# EAGLE design 13448_ATMEGA328_prog (EAGLE 7.7.0)
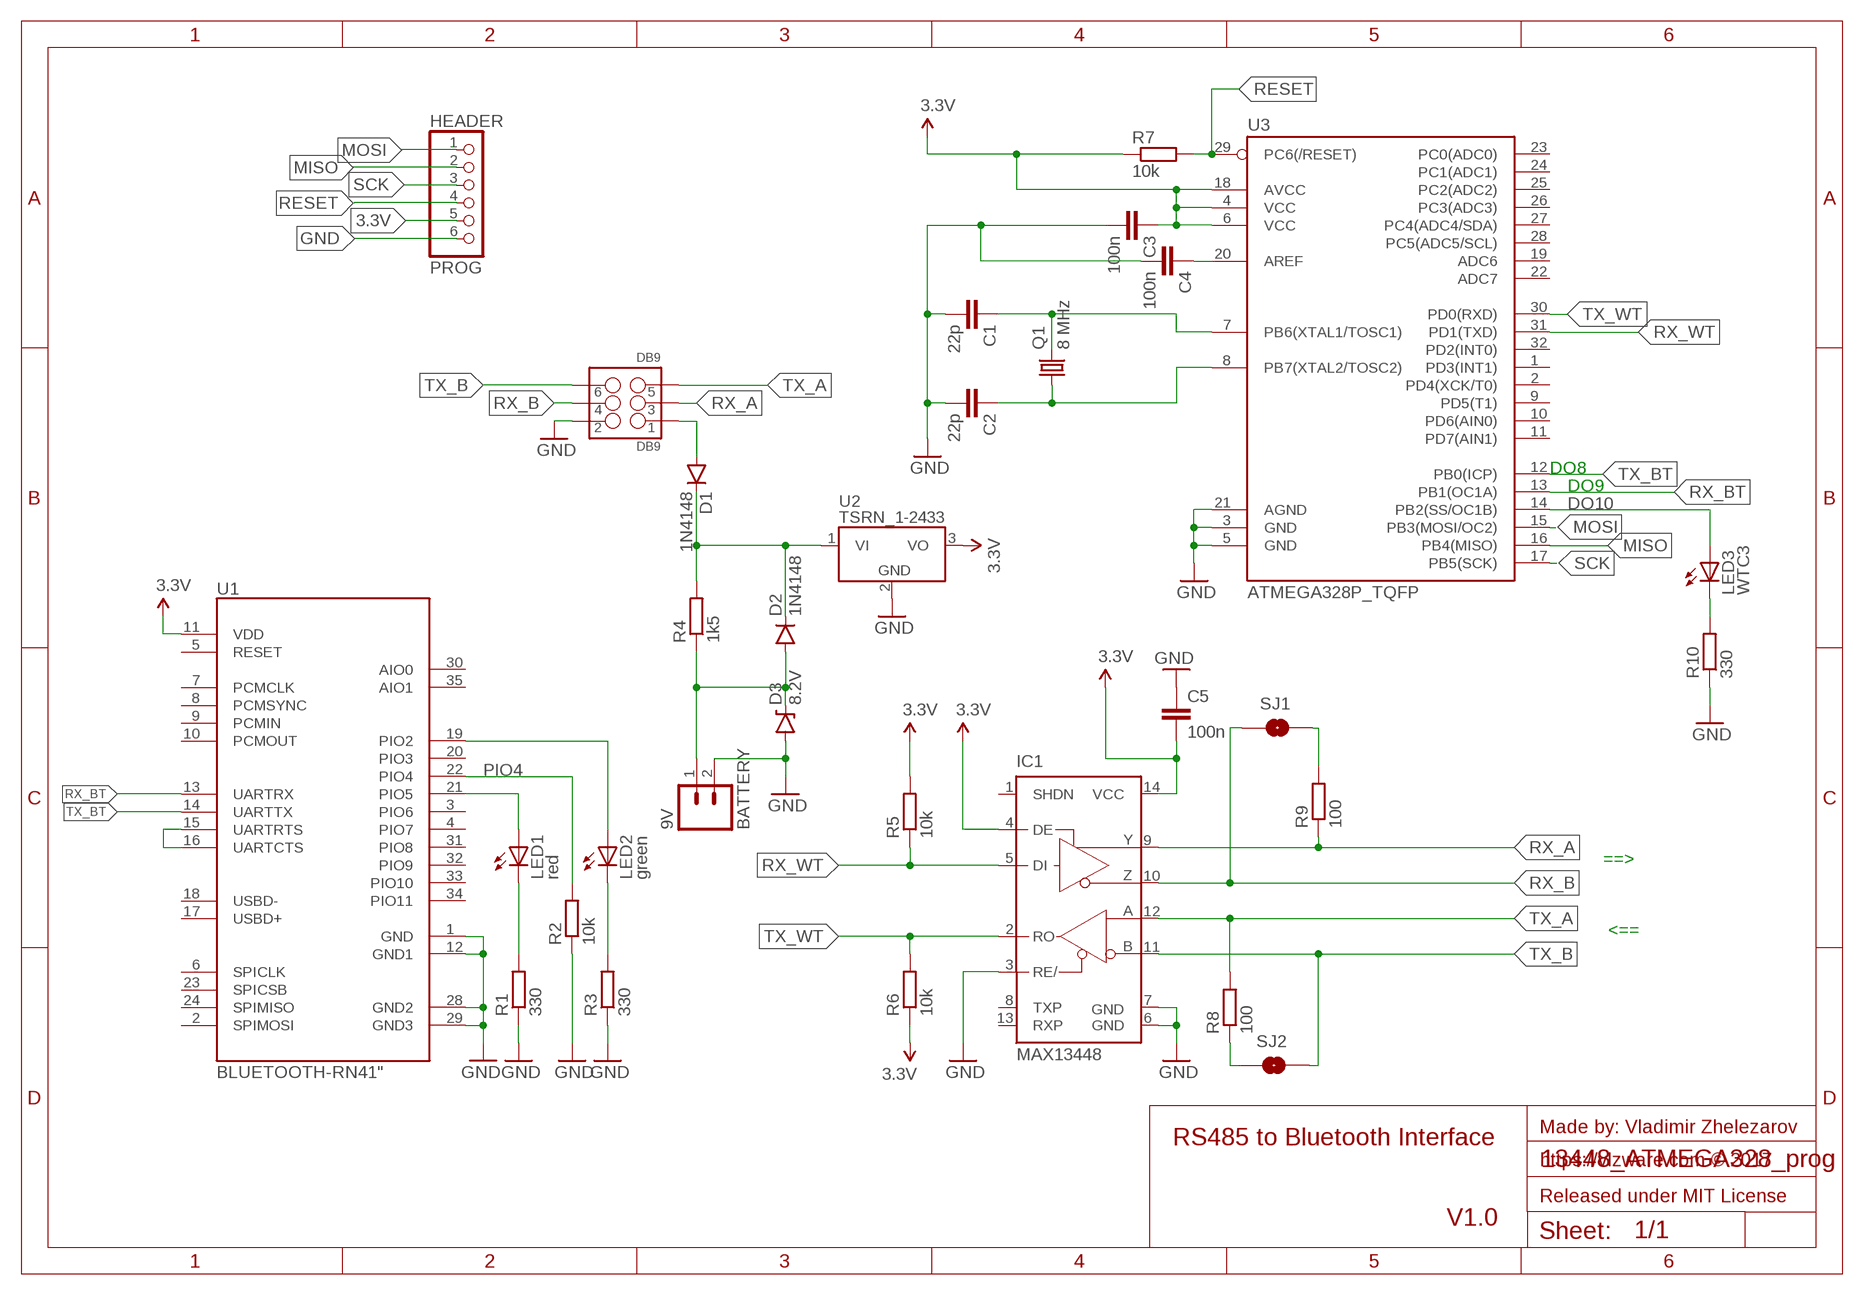
[diagram p0: schematic, sheet 1]

## Parts
BATTERY  9V  M02LOCK  [1X02_LOCK]
C1  22p  CAP1206  [1206]
C2  22p  CAP1206  [1206]
C3  100n  CAP1206  [1206]
C4  100n  CAP1206  [1206]
C5  100n  CAP1206  [1206]
D1  1N4148  DIODE1N4148  [DIODE-1N4148]
D2  1N4148  DIODE1N4148  [DIODE-1N4148]
D3  8.2V  DIODE-ZENER  [DIODE-BZT52]
DB9  DB9  M03X22X3_SILK_MALE_PTH  [2X3]
HEADER  PROG  PINHD-1X6  [1X06]
IC1  MAX13448  MAX3465CSD  [SO14]
LED1  red  LED3MM  [LED3MM]
LED2  green  LED3MM  [LED3MM]
LED3  WTC3  LED3MM  [LED3MM]
Q1  8 MHz  CRYSTALHC49UP  [HC49UP]
R1  330  R-EU_M1206  [M1206]
R2  10k  R-EU_M1206  [M1206]
R3  330  R-EU_M1206  [M1206]
R4  1k5  R-EU_0204/2V  [0204V]
R5  10k  R-EU_M1206  [M1206]
R6  10k  R-EU_M1206  [M1206]
R7  10k  R-EU_M1206  [M1206]
R8  100  R-EU_M1206  [M1206]
R9  100  R-EU_M1206  [M1206]
R10  330  R-EU_M1206  [M1206]
SJ1  SOLDERJUMPERNC  [SJ_2S]
SJ2  SOLDERJUMPERNC  [SJ_2S]
U1  BLUETOOTH-RN41"  [RN41]
U2  TSRN_1-2433  TSR_1-2450  [TSR-1]
U3  ATMEGA328P_TQFP  [TQFP32-08]

## Nets
3.3V: C3.1 C5.2 HEADER.5 IC1.4(DE) IC1.14(VCC) R5.2 R6.1 R7.1 U1.11(VDD) U2.3(VO) U3.4(VCC) U3.6(VCC) U3.18(AVCC)
24V: D1.A DB9.1
D1: LED1.K(C) R1.2
D2: LED2.K(C) R3.2
DO10: LED3.A U3.14(PB2(SS/OC1B))
GND: BATTERY.2 C1.2 C2.2 C3.2 C4.2 C5.1 D3.A DB9.2 HEADER.6 IC1.3(RE/) IC1.6(GND) IC1.7(GND) R1.1 R2.1 R3.1 R10.1 U1.1(GND) U1.12(GND1) U1.28(GND2) U1.29(GND3) U2.2(GND) U3.3(GND) U3.5(GND) U3.21(AGND)
MISO: HEADER.2 U3.16(PB4(MISO))
MOSI: HEADER.1 U3.15(PB3(MOSI/OC2))
N$1: LED1.A U1.21(PIO5)
N$2: LED2.A U1.19(PIO2)
N$3: U1.15(UARTRTS) U1.16(UARTCTS)
N$6: LED3.K(C) R10.2
N$7: R8.1 SJ2.1
N$8: R9.2 SJ1.2
N$11: BATTERY.1 D2.A D3.C R4.1
N$23: C4.1 U3.20(AREF)
N$25: C1.1 Q1.2 U3.7(PB6(XTAL1/TOSC1))
N$26: C2.1 Q1.1 U3.8(PB7(XTAL2/TOSC2))
PIO4: R2.2 U1.22(PIO4)
RESET: HEADER.4 R7.2 U3.29(PC6(/RESET))
RX_A: DB9.3 IC1.9(Y) R9.1
RX_B: DB9.4 IC1.10(Z) SJ1.1
RX_BT: U1.13(UARTRX) U3.13(PB1(OC1A))
RX_WT: IC1.5(DI) R5.1 U3.31(PD1(TXD))
SCK: HEADER.3 U3.17(PB5(SCK))
TX_A: DB9.5 IC1.12(A) R8.2
TX_B: DB9.6 IC1.11(B) SJ2.2
TX_BT: U1.14(UARTTX) U3.12(PB0(ICP))
TX_WT: IC1.2(RO) R6.2 U3.30(PD0(RXD))
VI: D1.C D2.C R4.2 U2.1(VI)
Unconnected: IC1.1(SHDN) IC1.8(TXP) IC1.13(RXP) U1.2(SPIMOSI) U1.3(PIO6) U1.4(PIO7) U1.5(RESET) U1.6(SPICLK) U1.7(PCMCLK) U1.8(PCMSYNC) U1.9(PCMIN) U1.10(PCMOUT) U1.17(USBD+) U1.18(USBD-) U1.20(PIO3) U1.23(SPICSB) U1.24(SPIMISO) U1.30(AIO0) U1.31(PIO8) U1.32(PIO9) U1.33(PIO10) U1.34(PIO11) U1.35(AIO1) U3.1(PD3(INT1)) U3.2(PD4(XCK/T0)) U3.9(PD5(T1)) U3.10(PD6(AIN0)) U3.11(PD7(AIN1)) U3.19(ADC6) U3.22(ADC7) U3.23(PC0(ADC0)) U3.24(PC1(ADC1)) U3.25(PC2(ADC2)) U3.26(PC3(ADC3)) U3.27(PC4(ADC4/SDA)) U3.28(PC5(ADC5/SCL)) U3.32(PD2(INT0))

## Notes on the sheet
- DO8
- DO9
- ==>
- <==
- Made by: Vladimir Zhelezarov
- RS485 to Bluetooth Interface
- https://vlzware.com © 2017
- Released under MIT License
- V1.0

## Library data of the parts
BATTERY = SparkFun-Connectors:M02: Standard 2-pin 0.1" header. Use with - straight break away headers ( PRT-00116) - right angle break away headers (PRT-00553) - swiss pins (PRT-00743) - machine pins (PRT-00117) - female headers (PRT-00115) Molex polarized connector foot print use with: PRT-08233 with associated crimp pins and housings. 2.54_SCREWTERM for use with PRT-10571. 3.5mm Screw Terminal footprints for PRT-08084 5mm Screw Terminal footprints for use with PRT-08432
C1-C5 = SparkFun-Capacitors:CAP: Capacitor Standard 0603 ceramic capacitor, and 0.1" leaded capacitor.
D1 D2 = SparkFun-DiscreteSemi:DIODE: Diode These are standard reverse protection diodes and small signal diodes. SMA package can handle up to about 1A. SOD-323 can handle about 200mA. What the SOD-323 package when ordering, there are some mfgs out there that are 5-pin packages.; PROD_ID: DIO-08378
D3 = SparkFun-DiscreteSemi:DIODE-ZENER: Zener Diode Production Part - 8199 3.4V Zener Voltage; PROD-ID: DIO-08199; VALUE: BZT52
DB9 = SparkFun-Connectors:M03X2: 2x3 .1" header. Shrouded, with keying- CONN-10681 SMT- CONN-11415 Pogo pins- HW-11044; PROD_ID: CONN-09701
HEADER = pinhead:PINHD-1X6: PIN HEADER
IC1 = maxim:MAX346*: +5V, Fail-Safe, 40Mbps, Profibus RS-485/RS-422 Transceivers Source: MAX3465-MAX3469.pdf; MPN: MAX3465CSD+; OC_FARNELL: unknown; OC_NEWARK: 65K6814
LED1-LED3 = adafruit:LED: LED OSRAM: - CHIPLED LG R971, LG N971, LY N971, LG Q971, LY Q971, LO R971, LY R971 LH N974, LH R974 LS Q976, LO Q976, LY Q976 LO Q996 - Hyper CHIPLED LW Q18S LB Q993, LB Q99A, LB R99A - SideLED LS A670, LO A670, LY A670, LG A670, LP A670 LB A673, LV A673, LT A673, LW A673 LH A674 LY A675 LS A676, LA A676, LO A676, LY A676, LW A676 LS A679, LY A679, LG A679 - Hyper Micro SIDELED® LS Y876, LA Y876, LO Y876, LY Y876 LT Y87S - SmartLED LW L88C, LW L88S LB L89C, LB L89S, LG L890 LS L89K, LO L89K, LY L89K LS L896, LA L896, LO L896, LY L896 - TOPLED LS T670, LO T670, LY T670, LG T670, LP T670 LSG T670, LSP T670, LSY T670, LOP T670, LYG T670 LG T671, LOG T671, LSG T671 LB T673, LV T673, LT T673, LW T673 LH T674 LS T676, LA T676, LO T676, LY T676, LB T676, LH T676, LSB T676, LW T676 LB T67C, LV T67C, LT T67C, LS T67K, LO T67K, LY T67K, LW E67C LS E67B, LA E67B, LO E67B, LY E67B, LB E67C, LV E67C, LT E67C LW T67C LS T679, LY T679, LG T679 LS T770, LO T770, LY T770, LG T770, LP T770 LB T773, LV T773, LT T773, LW T773 LH T774 LS E675, LA E675, LY E675, LS T675 LS T776, LA T776, LO T776, LY T776, LB T776 LHGB T686 LT T68C, LB T68C - Hyper Mini TOPLED® LB M676 - Mini TOPLED Santana® LG M470 LS M47K, LO M47K, LY M47K Source: http://www.osram.convergy.de/
Q1 = adafruit:CRYSTAL: CRYSTAL; OC_FARNELL: unknown; OC_NEWARK: unknown
R1-R10 = resistor:R-EU_: RESISTOR, European symbol
SJ1 SJ2 = SparkFun-Retired:SOLDERJUMPER: Solder Jumper Standard SMD solder jumper. Used to automate production. Two varients : Normally Open and Normally Closed are the same, but have different paste layers. NC will have a large amount of paste and should jumper during reflow.
U1 = SparkFun-RF:BLUETOOTH-RN41: Bluetooth SMD module
U2 = _traco_tsr-1:TSR_1-*: TRACO TSR-1 Series Point-of-Load DC/DC-Converters Vi max. 36 V; Vo = (1.2 .. 15)V ±2%; Io = 0 .. 1 A SIP-Package (drop-in replacement for 78xx linear voltage regulators in TO220-package, vertically assembled) Source: www.tracopower.com Technologies: TSR 1- Vi (V) Vo (V) ±2% Io = 0 .. 1 A 24_ ( generic ) 2412 4.6 .. 36 1.2 2415 4.6 .. 36 1.5 2418 4.6 .. 36 1.8 2425 4.6 .. 36 2.5 2433 4.75.. 36 3.3 2450 6.5 .. 36 5.0 2465 9.0 .. 36 6.5 2490 12 .. 36 9.0 24120 15 .. 36 12 24150 18 .. 36 15 Author: Dipl.-Ing. FH Rainer Bayer HHN Hochschule Heilbronn, rainer.bayer@hs-heilbronn.de Ingenieurbüro ing-rb, mail@ing-rb.de
U3 = SparkFun-DigitalIC:ATMEGA328P_TQFP; PROD_ID: IC-09069

## Board
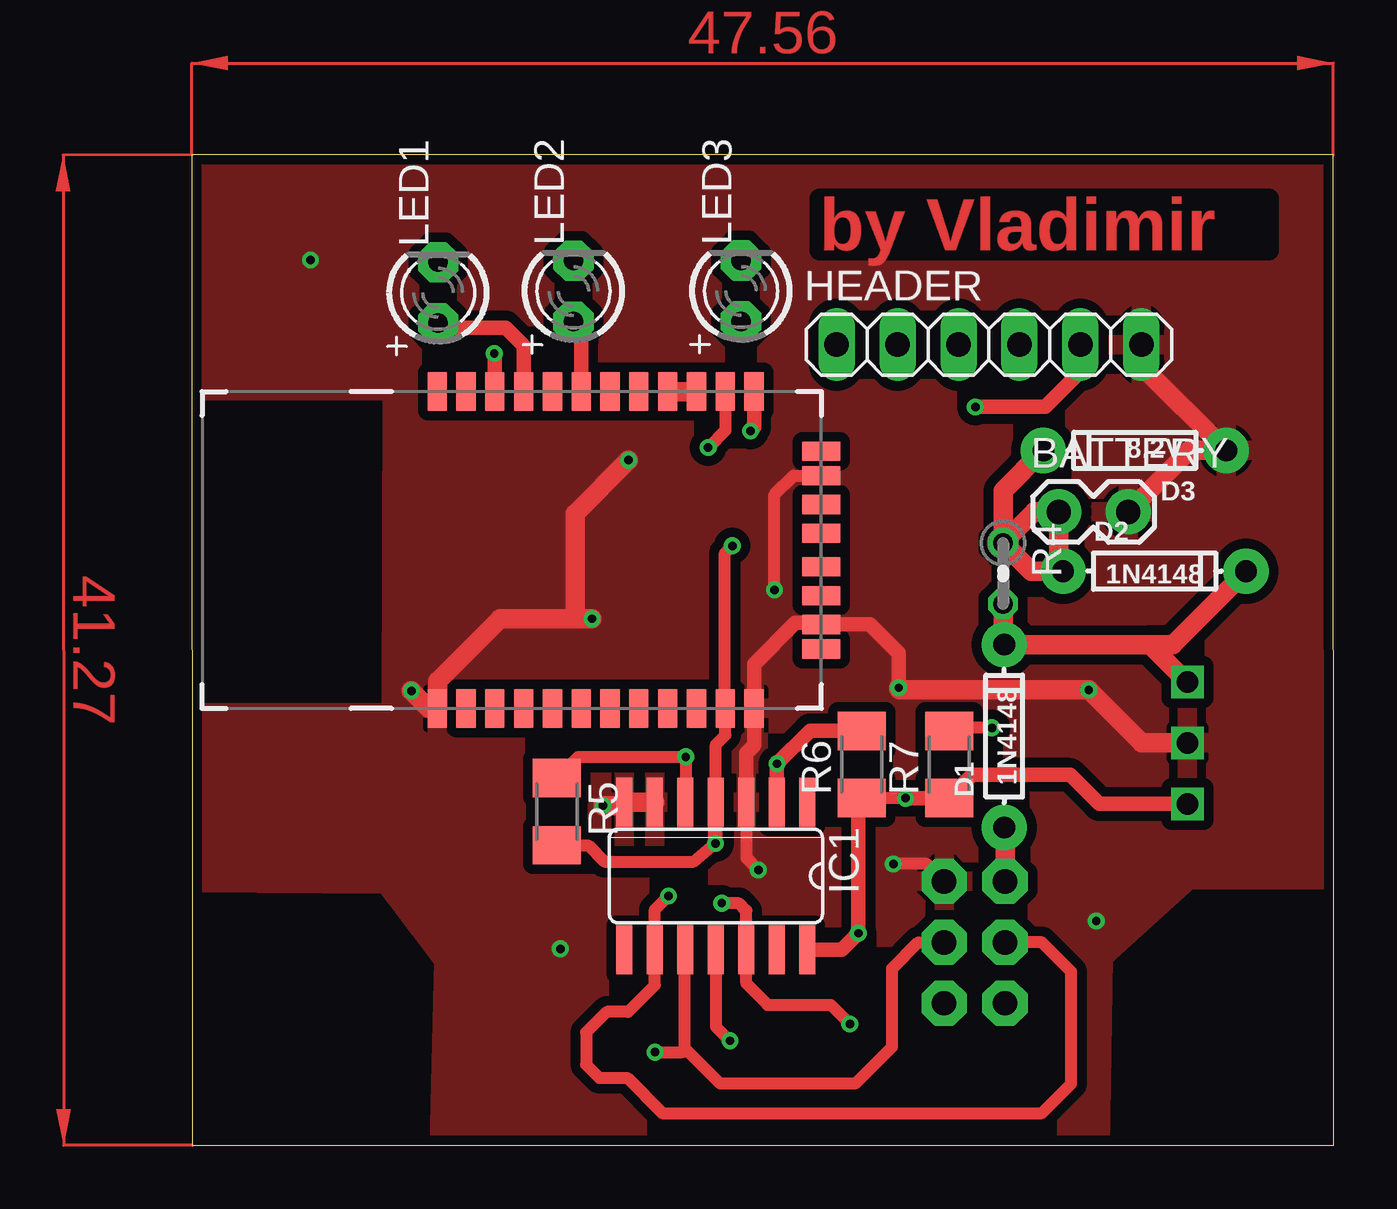
[diagram p1: board, top side]
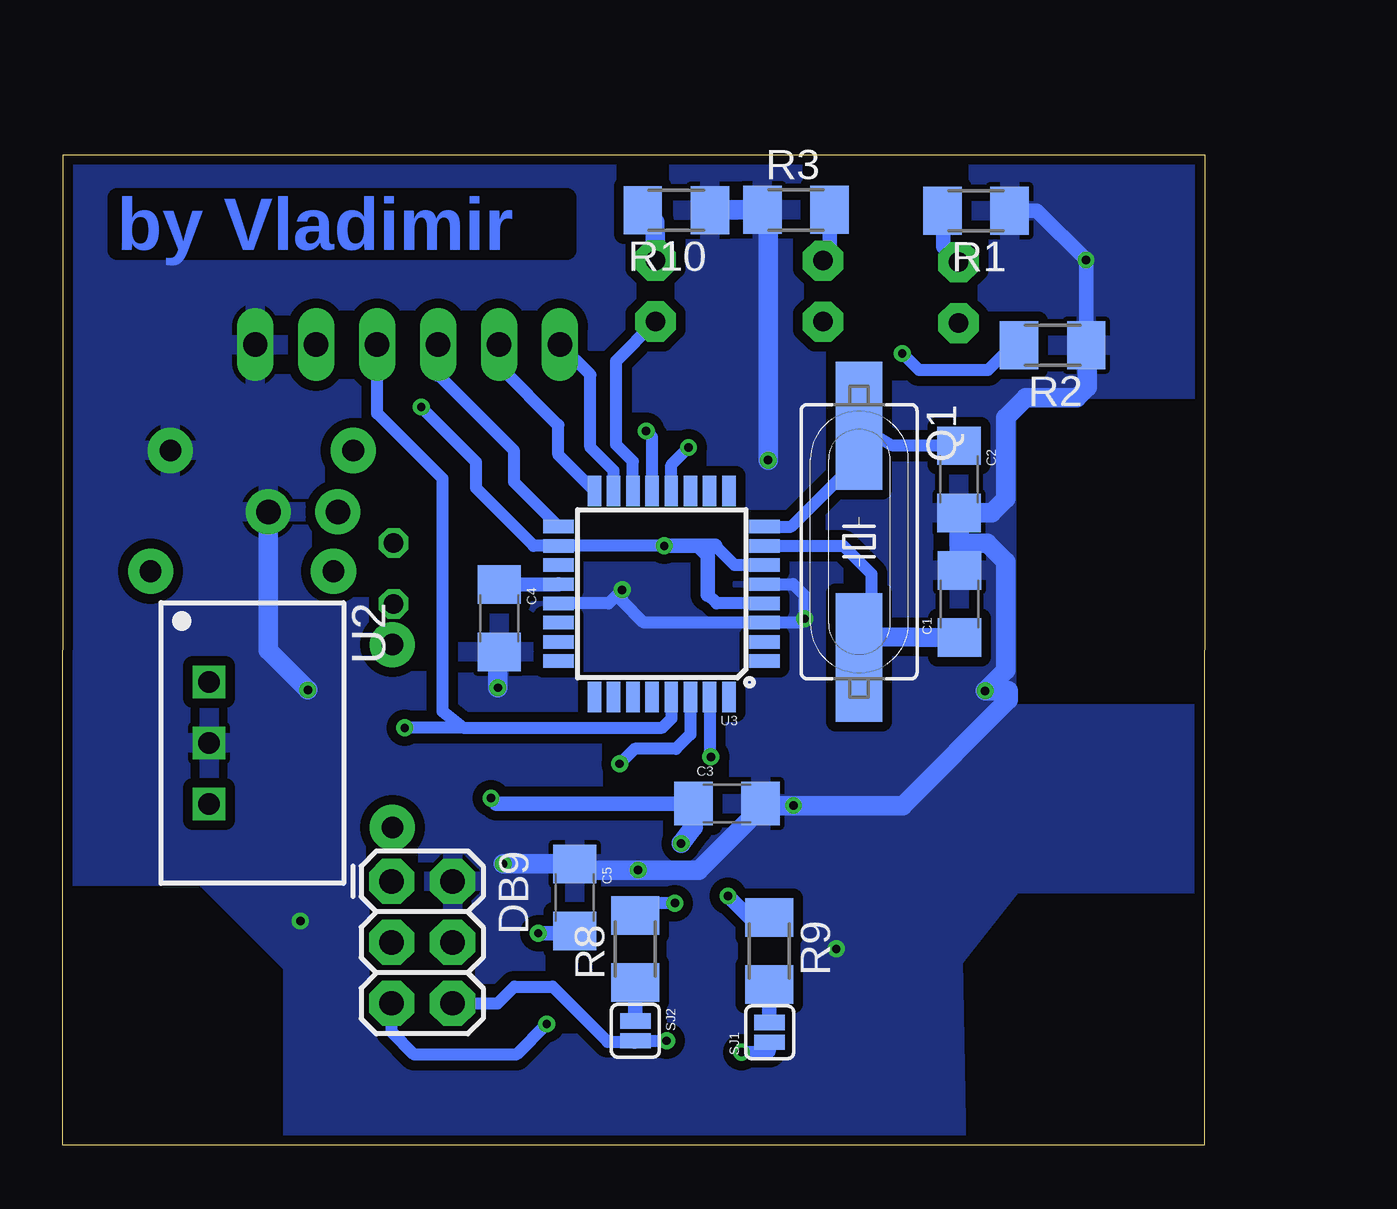
[diagram p2: board, bottom side, seen from below]

Size 47.58 x 41.27 mm. Coordinates in mm from the lower left corner, seen from the top.
Outline: 0.02,0 47.58,0 47.56,41.27 0,41.27 0.02,0
Copper layers (1*16): Top 0.018mm / dielectric 1.55mm / Bottom 0.018mm
Design rules "eC_2Layer_PClass6_BaseCopperO18_eCDefault": minimum track width 0.15mm, minimum drill 0.35mm, track to track 0.15mm, track to pad 0.15mm, pad to pad 0.15mm, via to via 0.15mm, smd to smd 0mil, copper to edge 0.25mm, drill to drill 0.35mm, minimum pad ring 0.175mm, minimum via ring 0.125mm, stop-mask expansion 0mil, vias tented up to drill 0.45mm, thermal gap 0.2mm

### Footprints (pad centres in the part's own frame; a part is rotated, then mirrored left to right if it is on the bottom)
1X02_LOCK = drill 1.016 pad 1.88: 1 -0.178,0; 2 2.718,0
1206 = smd 1.6 x 1.8: 1 -1.4,0; 2 1.4,0
DIODE-1N4148 = drill 0.9 pad 1.88: A -3.81,0; C 3.81,0
DIODE-BZT52 = drill 0.9 pad 1.88: A -3.81,0; C 3.81,0
2X3 = drill 1.016 pad 1.88 octagon: 1 0,0; 2 0,2.54; 3 2.54,0; 4 2.54,2.54; 5 5.08,0; 6 5.08,2.54
1X06 = drill 1.016 long: 1 -6.35,0; 2 -3.81,0; 3 -1.27,0; 4 1.27,0; 5 3.81,0; 6 6.35,0
SO14 = smd 0.66 x 2.032: 1 -3.81,-3.073; 2 -2.54,-3.073; 3 -1.27,-3.073; 4 0,-3.073; 5 1.27,-3.073; 6 2.54,-3.073; 7 3.81,-3.073; 8 3.81,3.073; 9 2.54,3.073; 10 1.27,3.073; 11 0,3.073; 12 -1.27,3.073; 13 -2.54,3.073; 14 -3.81,3.073
LED3MM = drill 0.813 pad 1.676 octagon: A -1.27,0; K 1.27,0
HC49UP = smd 5.334 x 1.93: 1 -4.826,0; 2 4.826,0
M1206 = smd 1.6 x 2: 1 -1.4,0; 2 1.4,0
0204V = drill 0.813 octagon: 1 -1.27,0; 2 1.27,0
SJ_2S = smd 0.635 x 1.27: 1 -0.412,0; 2 0.412,0
RN41 = smd 0.8 x 1.6: 1 -6.6,-6.6; 2 -5.4,-6.6; 3 -4.2,-6.6; 4 -3,-6.6; 5 -1.8,-6.6; 6 -0.6,-6.6; 7 0.6,-6.6; 8 1.8,-6.6; 9 3,-6.6; 10 4.2,-6.6; 11 5.4,-6.6; 12 6.6,-6.6; 13 6.6,6.6; 14 5.4,6.6; 15 4.2,6.6; 16 3,6.6; 17 1.8,6.6; 18 0.6,6.6; 19 -0.6,6.6; 20 -1.8,6.6; 21 -3,6.6; 22 -4.2,6.6; 23 -5.4,6.6; 24 -6.6,6.6 | smd 1.6 x 0.8: 28 9.4,3.1; 29 9.4,-3.1; 30 9.4,4.122; 31 9.4,1.9; 32 9.4,0.7; 33 9.4,-0.7; 34 9.4,-1.9; 35 9.4,-4.122
TSR-1 = drill 0.9 square: 1 -2.54,0; 2 0,0; 3 2.54,0
TQFP32-08 = smd 1.27 x 0.559: 1 -4.293,2.8; 2 -4.293,2; 3 -4.293,1.2; 4 -4.293,0.4; 5 -4.293,-0.4; 6 -4.293,-1.2; 7 -4.293,-2; 8 -4.293,-2.8; 17 4.293,-2.8; 18 4.293,-2; 19 4.293,-1.2; 20 4.293,-0.4; 21 4.293,0.4; 22 4.293,1.2; 23 4.293,2; 24 4.293,2.8 | smd 0.559 x 1.27: 9 -2.8,-4.293; 10 -2,-4.293; 11 -1.2,-4.293; 12 -0.4,-4.293; 13 0.4,-4.293; 14 1.2,-4.293; 15 2,-4.293; 16 2.8,-4.293; 25 2.8,4.293; 26 2,4.293; 27 1.2,4.293; 28 0.4,4.293; 29 -0.4,4.293; 30 -1.2,4.293; 31 -2,4.293; 32 -2.8,4.293

### Placement (x,y rotation side)
BATTERY  36.29,26.4 0 top
C1  10.22,22.55 90 bottom
C2  10.24,27.75 270 bottom
C3  19.9,14.24 0 bottom
C4  29.39,21.96 270 bottom
C5  26.24,10.32 270 bottom
D1  33.84,17.05 90 top
D2  40.11,23.92 0 top
D3  39.28,28.95 180 top
DB9  33.88,11 270 bottom
HEADER  33.21,33.36 0 top
IC1  21.83,11.22 180 top
LED1  10.26,35.53 90 top
LED2  15.9,35.59 90 top
LED3  22.88,35.6 90 top
Q1  14.4,25.15 270 bottom
R1  9.53,38.94 180 bottom
R2  6.33,33.34 180 bottom
R3  17.02,38.97 0 bottom
R4  33.79,23.83 270 top
R5  15.21,13.9 270 top
R6  27.9,15.87 90 top
R7  31.55,15.86 90 top
R8  23.73,8.18 90 bottom
R9  18.14,8.1 270 bottom
R10  22.01,38.97 180 bottom
SJ1  18.12,4.71 90 bottom
SJ2  23.72,4.77 270 bottom
U1  16.82,24.8 0 top
U2  41.48,16.77 270 bottom
U3  22.62,22.98 180 bottom

### Tracks (layer width: path | path; a pad name or v marks a point on that pad's centre or on a via)
3.3V  (via drill 0.35 pad 0.7)
  Top 0.508: IC1.4 21.83,16.7 22.22,17.09 U1.11 22.21,18.22 22.21,24.67 v22.51,24.98 | R5.2 16.5,12.5 17.18,11.82 20.9,11.82 v21.81,12.58 | v29.73,14.46 v29.72,14.47 R6.1 27.89,14.48 27.77,14.48
  Top 0.61: v32.64,30.77 35.56,30.77 37.02,32.23 HEADER.5 | U2.3 37.8,14.23 36.6,15.43 32.51,15.43 R7.1 v29.73,14.46 | IC1.4 v21.81,12.58 | IC1.14 27.08,8.15 v27.77,8.84 27.77,14.48 | 27.91,14.46 R6.1
  Bottom 0.508: v22.51,24.98 U3.18 27.95,24.98 30.36,27.38 30.36,28.46 32.66,30.77 | U3.6 19.58,24.18 20.39,24.98 | U3.4 20.33,22.58 20.7,22.95
  Bottom 0.61: 21.1,24.98 v22.51,24.98 | 21.1,24.98 20.39,24.98 | 20.7,22.95 20.7,24.58 21.1,24.98 | 32.66,30.77 v32.64,30.77 | 21.3,13.26 C3.1 29.51,14.24 v29.73,14.46 | v27.77,8.84 26.33,8.84 C5.2
  Bottom 0.813: v21.81,12.58 21.3,13.26
24V
  Top 0.813: DB9.1 33.88,13.21 D1.A
D1
  Bottom 0.61: 10.9,38.91 10.9,37.44 LED1.K
  Bottom 0.813: R1.2 10.9,38.91
D2
  Bottom 0.61: R3.2 15.62,37.13 LED2.K
  Bottom 0.813: R3.2
DO10
  Bottom 0.508: U3.14 23.82,28.5 24.52,29.2 24.52,32.68 LED3.A
GND  (via drill 0.35 pad 0.7)
  Top 0.508: DB9.2 30.61,11.72 v29.22,11.72 | IC1.3 23.1,11.97 v23.6,11.47 | v24.27,23.15 24.27,27.12 25.06,27.9 U1.28
  Top 0.61: IC1.3 23.1,16.34 23.43,16.67 23.43,18.2 U1.12 23.42,20.05 25.14,21.77 26.16,21.77 arc-90 U1.29 28.25,21.7 29.44,20.51 v29.45,19.07
  Top 0.813: IC1.6 IC1.7 17.88,14.16 v17.13,14.16 | v9.14,18.94 9.88,18.2 U1.1 10.23,18.22 10.23,19.33 12.85,21.94 15.96,21.94 | v16.67,21.94 15.96,21.94 | U2.2 39.58,16.77 v37.37,18.98 29.54,18.98 arc-90 v29.45,19.07 | HEADER.6 39.56,32.49 D3.A 41.57,28.95 BATTERY.2 | 15.96,21.94 15.96,26.32 v18.19,28.55
  Bottom 0.508: U3.21 24.84,22.58 v24.27,23.15 24.27,22.69 23.36,21.78 U3.3 16.83,21.78 v16.67,21.94 16.68,21.96 16.68,22.92 17.14,23.38 U3.5
  Bottom 0.61: R2.1 4.93,36.88 v4.94,36.89 7,38.94 R1.1
  Bottom 0.813: C1.2 10.22,25.14 | 10.22,25.14 10.22,26.33 C2.2 8.87,26.35 8.29,26.94 8.29,30.32 7.45,31.15 5.32,31.15 4.88,31.59 4.88,33.29 R2.1 | 10.22,25.14 10.16,25.08 9.06,25.08 8.29,24.31 8.29,19.79 v9.14,18.94 8.18,18.94 8.18,18.56 12.58,14.16 v17.13,14.16 18.41,14.16 C3.2 18.5,14.05 21.08,11.47 v23.6,11.47 25.99,11.47 C5.1 v29.22,11.72 | R10.1 R3.1 18.19,38.74 v18.19,28.55 | BATTERY.2 39.01,20.62 v37.37,18.98 | C4.2 29.45,20.5 v29.45,19.07
  other vias: 15.35,8.19 37.68,9.35
  pour Top (isolate 0.406): 8.34,31.42 8.31,18.03 0.09,18.03 0.03,10.94 8.07,10.88 10.5,7.68 10.3,-0.04 37.84,-0.07 37.98,7.83 41.54,11.06 47.54,11.06 47.54,41.13 0.04,41.13 0.04,31.43
  pour Bottom (isolate 0.406): -0.05,31.5 8.25,31.5 8.25,17.98 0.09,17.98 0.09,10.9 7.99,10.88 10.48,7.73 10.33,-0.12 38,0.02 38,7.49 41.73,11.21 47.41,11.21 47.41,41.23 -0.02,41.23
MISO
  Bottom 0.508: U3.16 26.92,28.77 26.92,30.01 29.4,32.49
  Bottom 0.813: 29.4,32.49 HEADER.2
MOSI
  Bottom 0.508: U3.15 24.62,28.11 25.59,29.08 25.59,32.1 HEADER.1
N$1
  Top 0.61: U1.21 13.82,33.32 13.07,34.07 11.37,34.07 | 11.37,34.07 10.91,34.07 | 11.37,34.07 10.45,34.07 LED1.A
N$2
  Top 0.61: U1.19 16.22,33.52 16.22,33.99 LED2.A
N$3
  Top 0.813: U1.16 U1.15
N$6
  Bottom 0.813: R10.2 22.91,38.47 LED3.K
N$7
  Bottom 0.61: SJ2.1 R8.1
N$8
  Bottom 0.61: R9.2 18.14,5.14 SJ1.2
N$11
  Top 0.813: R4.1 33.79,27.27 D3.C | R4.1 35.09,26.4 BATTERY.1 36.12,24.11 D2.A 34.97,23.92 R4.1
N$23
  Bottom 0.61: U3.20 C4.1
N$25
  Bottom 0.508: U3.7 15.05,24.98 13.87,23.8 13.87,21.4
  Bottom 0.61: 13.87,21.4 13.87,20.38 Q1.2
  Bottom 0.813: C1.1 13.67,21.2 13.87,21.4
N$26
  Bottom 0.508: C2.1 12.99,29.15 Q1.1 | U3.8 17.23,25.78 14.67,28.34
  Bottom 0.61: 14.67,28.34 14.67,29.71 Q1.1
PIO4  (via drill 0.35 pad 0.7)
  Top 0.508: 12.62,32.73 v12.6,32.99
  Top 0.61: U1.22 12.62,32.73
  Bottom 0.508: 8.34,32.73 R2.2 8,33.34 9.03,32.3 11.9,32.3 v12.6,32.99
RESET  (via drill 0.35 pad 0.7)
  Top 0.508: v33.33,17.4 31.15,17.4 R7.2
  Bottom 0.508: HEADER.4 34.48,30.5 31.76,27.79 31.76,18.08 30.9,17.4 | U3.29 22.22,17.78 22.6,17.4 30.9,17.4 | 30.9,17.4 v33.32,17.4 v33.33,17.4
RX_A  (via drill 0.35 pad 0.7)
  Top 0.508: DB9.3 35.42,8.46 36.63,7.24 36.63,2.57 35.41,1.35 19.59,1.35 18.13,2.81 16.98,2.81 16.43,3.36 16.43,4.71 17.28,5.56 18.17,5.56 19.29,6.68 IC1.9 19.29,9.82 v19.86,10.39
  Bottom 0.61: R9.1 18.97,9.5 v19.86,10.39
RX_B  (via drill 0.35 pad 0.7)
  Top 0.508: 20.54,4.04 20.54,8.13 | DB9.4 30.27,8.46 29.17,7.36 29.17,4.1 27.63,2.57 22.01,2.57 20.54,4.04 | v19.3,3.88 20.38,3.88 arc90 20.54,4.04
  Top 0.61: 20.54,8.13 IC1.10
  Bottom 0.508: SJ1.1 18.12,3.89 v19.3,3.88
RX_BT  (via drill 0.35 pad 0.7)
  Top 0.61: v23.27,29.76 23.42,29.92 U1.13
  Bottom 0.508: U3.13 23.02,29.52 v23.27,29.76
RX_WT  (via drill 0.35 pad 0.7)
  Top 0.508: 20.57,14.31 v20.57,16.19 16.09,16.19 R5.1
  Top 0.61: 20.57,14.31 IC1.5
  Bottom 0.508: U3.31 20.62,16.24
  Bottom 0.61: 20.62,16.24 v20.57,16.19
SCK
  Bottom 0.508: U3.17 28.78,27.64 28.78,28.94 31.94,32.1
  Bottom 0.61: 31.94,32.1 HEADER.3
TX_A  (via drill 0.35 pad 0.7)
  Top 0.508: v27.41,5.06 26.61,5.86 23.99,5.86 23.1,6.75 IC1.12 23.1,9.78 22.8,10.08 22.09,10.08 v22.07,10.09
  Bottom 0.508: v27.41,5.06 28.69,3.78 32.93,3.78 33.88,4.74 DB9.5 | v22.07,10.09 23.21,10.1 R8.2
TX_B  (via drill 0.35 pad 0.7)
  Top 0.508: IC1.11 21.83,4.95 v22.42,4.36
  Bottom 0.508: 31.32,5.9 29.47,5.9 28.76,6.61 27.17,6.61 24.87,4.31 23.77,4.31 | SJ2.2 v22.42,4.36
  Bottom 0.61: 31.32,5.9 DB9.6 | 23.77,4.31 arc-90 SJ2.2 | v22.42,4.36 arc90 v22.42,4.36
TX_BT  (via drill 0.35 pad 0.7)
  Top 0.508: U1.14 22.22,29.79 v21.51,29.07
  Top 0.61: 22.23,31.4 U1.14
  Bottom 0.508: v21.51,29.07 22.22,28.36 U3.12
TX_WT  (via drill 0.35 pad 0.7)
  Top 0.61: IC1.2 v24.37,15.9 25.75,17.28 R6.2
  Bottom 0.508: U3.30 21.42,17.13 22.03,16.52 23.75,16.52 v24.37,15.9
VI
  Top 0.813: 39.92,20.86 D1.C 33.79,20.91 R4.2 | 39.92,20.86 U2.1 | 39.92,20.86 40.86,20.86 D2.C
(copper drawn outside any net)
  shapes: Top area x2

### Text on the board
Top: by Vladimir | RS485 to Bluetooth Interface V1.0 / https://vlzware.com © 2017 / Released under MIT License
Bottom: by Vladimir